# Altium schematic sheet SistemaMinimo-dsPIC33FJ64MC804.SchDoc
size A4
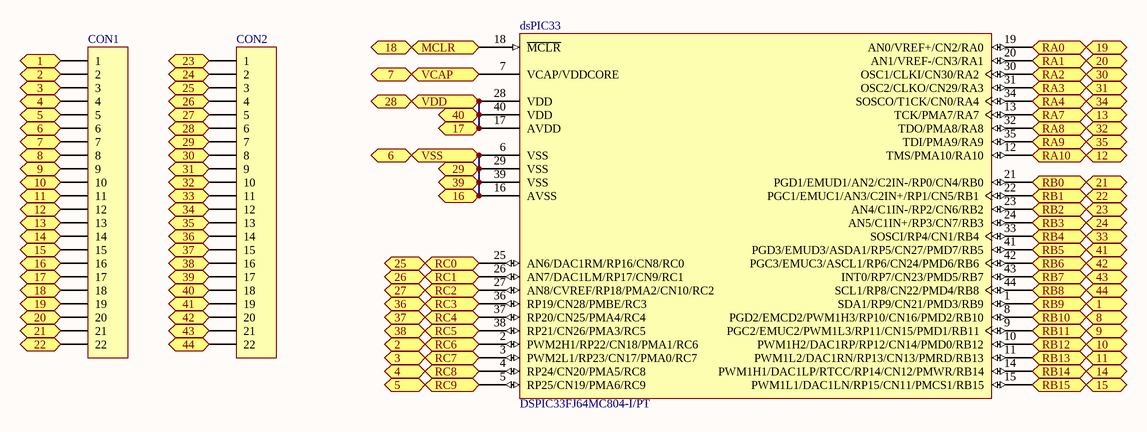
[diagram p0: SistemaMinimo-dsPIC33FJ64MC804.SchDoc]

## Parts
CON1  Header 22  [HDR1X22]  (value not drawn)
CON2  Header 22  [HDR1X22]  (value not drawn)
dsPIC33  DSPIC33FJ64MC804-I/PT  [TQFP-PT44_N]

## Ports
1, 2, 3, 4, 5, 6, 7, 8, 9, 10, 11, 12, 13, 14, 15, 16, 17, 18, 19, 20, 21, 22, 23, 24, 25, 26, 27, 28, 29, 30, 31, 32, 33, 34, 35, 36, 37, 38, 39, 40, 41, 42, 43, 44, MCLR, RA0, RA1, RA2, RA3, RA4, RA7, RA8, RA9, RA10, RB0, RB1, RB2, RB3, RB4, RB5, RB6, RB7, RB8, RB9, RB10, RB11, RB12, RB13, RB14, RB15, RC0, RC1, RC2, RC3, RC4, RC5, RC6, RC7, RC8, RC9, VCAP, VDD, VSS

## Nets
1: CON1.1 dsPIC33.1(SDA1/RP9/CN21/PMD3/RB9) ; port RB9, port 1
2: CON1.2 dsPIC33.2(PWM2H1/RP22/CN18/PMA1/RC6) ; port RC6, port 2
3: CON1.3 dsPIC33.3(PWM2L1/RP23/CN17/PMA0/RC7) ; port RC7, port 3
4: CON1.4 dsPIC33.4(RP24/CN20/PMA5/RC8) ; port RC8, port 4
5: CON1.5 dsPIC33.5(RP25/CN19/PMA6/RC9) ; port RC9, port 5
7: CON1.7 dsPIC33.7(VCAP/VDDCORE) ; port VCAP, port 7
8: CON1.8 dsPIC33.8(PGD2/EMCD2/PWM1H3/RP10/CN16/PMD2/RB10) ; port RB10, port 8
9: CON1.9 dsPIC33.9(PGC2/EMUC2/PWM1L3/RP11/CN15/PMD1/RB11) ; port RB11, port 9
10: CON1.10 dsPIC33.10(PWM1H2/DAC1RP/RP12/CN14/PMD0/RB12) ; port RB12, port 10
11: CON1.11 dsPIC33.11(PWM1L2/DAC1RN/RP13/CN13/PMRD/RB13) ; port RB13, port 11
12: CON1.12 dsPIC33.12(TMS/PMA10/RA10) ; port RA10, port 12
13: CON1.13 dsPIC33.13(TCK/PMA7/RA7) ; port RA7, port 13
14: CON1.14 dsPIC33.14(PWM1H1/DAC1LP/RTCC/RP14/CN12/PMWR/RB14) ; port RB14, port 14
15: CON1.15 dsPIC33.15(PWM1L1/DAC1LN/RP15/CN11/PMCS1/RB15) ; port RB15, port 15
16: CON1.6 CON1.16 CON2.7 CON2.17 dsPIC33.6(VSS) dsPIC33.16(AVSS) dsPIC33.29(VSS) dsPIC33.39(VSS) ; port VSS, port 6, port 16, port 29, port 39
17: CON1.17 CON2.6 CON2.18 dsPIC33.17(AVDD) dsPIC33.28(VDD) dsPIC33.40(VDD) ; port VDD, port 17, port 28, port 40
18: CON1.18 dsPIC33.18(~{MCLR}) ; port MCLR, port 18
19: CON1.19 dsPIC33.19(AN0/VREF+/CN2/RA0) ; port RA0, port 19
20: CON1.20 dsPIC33.20(AN1/VREF-/CN3/RA1) ; port RA1, port 20
21: CON1.21 dsPIC33.21(PGD1/EMUD1/AN2/C2IN-/RP0/CN4/RB0) ; port RB0, port 21
22: CON1.22 dsPIC33.22(PGC1/EMUC1/AN3/C2IN+/RP1/CN5/RB1) ; port RB1, port 22
23: CON2.1 dsPIC33.23(AN4/C1IN-/RP2/CN6/RB2) ; port RB2, port 23
24: CON2.2 dsPIC33.24(AN5/C1IN+/RP3/CN7/RB3) ; port RB3, port 24
25: CON2.3 dsPIC33.25(AN6/DAC1RM/RP16/CN8/RC0) ; port RC0, port 25
26: CON2.4 dsPIC33.26(AN7/DAC1LM/RP17/CN9/RC1) ; port RC1, port 26
27: CON2.5 dsPIC33.27(AN8/CVREF/RP18/PMA2/CN10/RC2) ; port RC2, port 27
30: CON2.8 dsPIC33.30(OSC1/CLKI/CN30/RA2) ; port RA2, port 30
31: CON2.9 dsPIC33.31(OSC2/CLKO/CN29/RA3) ; port RA3, port 31
32: CON2.10 dsPIC33.32(TDO/PMA8/RA8) ; port RA8, port 32
33: CON2.11 dsPIC33.33(SOSCI/RP4/CN1/RB4) ; port RB4, port 33
34: CON2.12 dsPIC33.34(SOSCO/T1CK/CN0/RA4) ; port RA4, port 34
35: CON2.13 dsPIC33.35(TDI/PMA9/RA9) ; port RA9, port 35
36: CON2.14 dsPIC33.36(RP19/CN28/PMBE/RC3) ; port RC3, port 36
37: CON2.15 dsPIC33.37(RP20/CN25/PMA4/RC4) ; port RC4, port 37
38: CON2.16 dsPIC33.38(RP21/CN26/PMA3/RC5) ; port RC5, port 38
41: CON2.19 dsPIC33.41(PGD3/EMUD3/ASDA1/RP5/CN27/PMD7/RB5) ; port RB5, port 41
42: CON2.20 dsPIC33.42(PGC3/EMUC3/ASCL1/RP6/CN24/PMD6/RB6) ; port RB6, port 42
43: CON2.21 dsPIC33.43(INT0/RP7/CN23/PMD5/RB7) ; port RB7, port 43
44: CON2.22 dsPIC33.44(SCL1/RP8/CN22/PMD4/RB8) ; port RB8, port 44

## Library data of the parts
CON1 CON2 = Header 22: Header, 22-Pin; LatestRevisionDate: 17-Jul-2002; LatestRevisionNote: Re-released for DXP Platform.; Publisher: Altium Limited
dsPIC33 = DSPIC33FJ64MC804-I/PT: High-Performance 16-bit Digital Signal Controller, 64 KB Flash, 16 KB RAM, 44-Pin TQFP, Industrial Temperature; Published: 2-Dec-2009; DatasheetVersion: revD, Nov-2009; PackageVersion: revBB, Aug-2009; PackageReference: TQFP-PT44; Publisher: Altium Limited; PackageDescription: 44-Lead Plastic Thin Quad Flatpack (PT) - 10x10x1mm Body, 2.00mm [TQFP]; Supplier 1: Digi-Key; Supplier Part Number 1: DSPIC33FJ64MC804-I/PT-ND; Supplier 2: Farnell; Supplier Part Number 2: 1576844; Code_JEDEC: MS-026; ComponentLink1Description: Datasheet; ComponentLink1URL: http://ww1.microchip.com/downloads/en/DeviceDoc/70291D.pdf; ComponentLink2Description: Packaging Specification; ComponentLink2URL: http://www.microchip.com/stellent/groups/techpub_sg/documents/packagingspec/en012702.pdf; ComponentLink3Description: Microchip.com Home; ComponentLink3URL: http://www.microchip.com/